# EAGLE design Power Board (EAGLE 9.6.2)
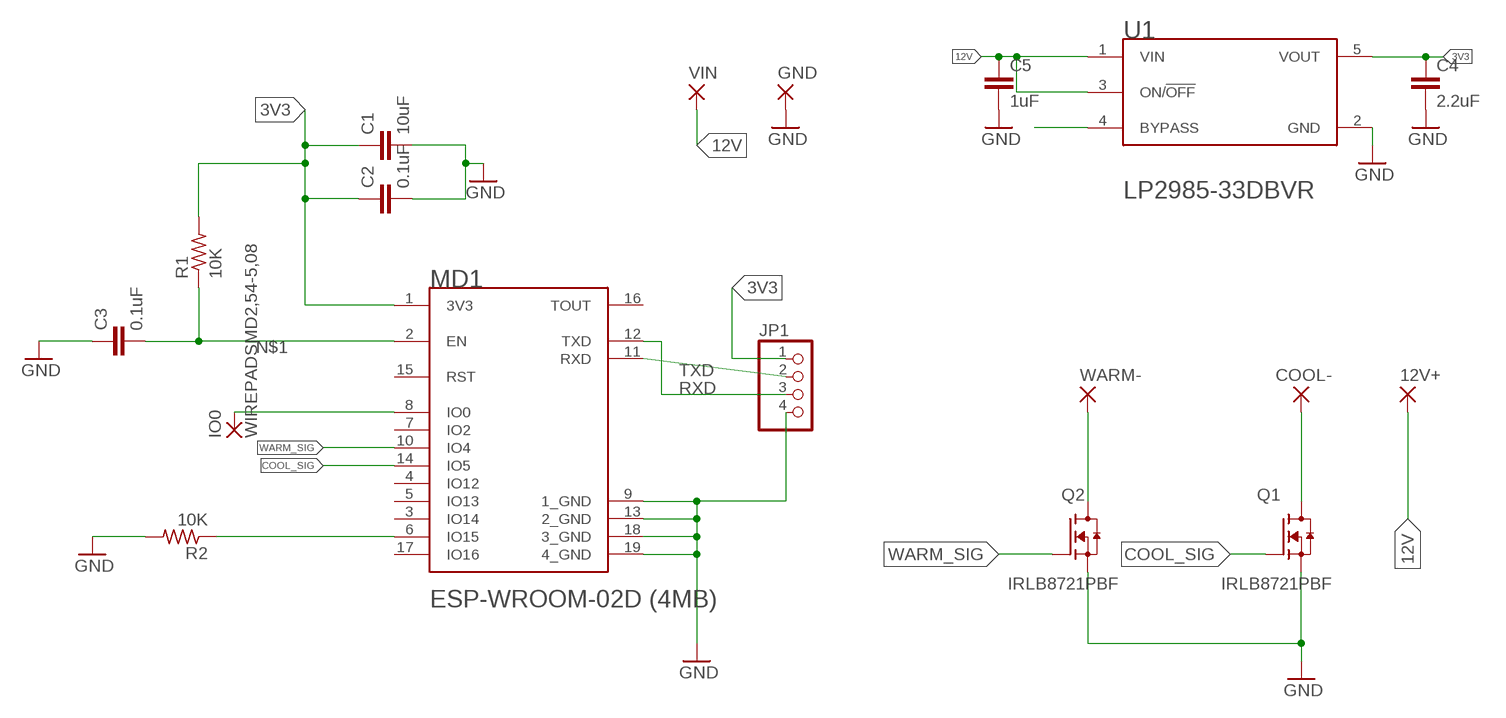
[diagram p0: schematic, sheet 1]

## Parts
12V+  WIREPADSMD5-2,5  [5-2,5]
C1  10uF  C-EUC1206  [C1206]
C2  0.1uF  C-EUC1206  [C1206]
C3  0.1uF  C-EUC1206  [C1206]
C4  2.2uF  C-EUC1206  [C1206]
C5  1uF  C-EUC1206  [C1206]
COOL-  WIREPADSMD5-2,5  [5-2,5]
GND  WIREPADSMD5-2,5  [5-2,5]
IO0  WIREPADSMD2,54-5,08  [SMD2,54-5,08]
JP1  PINHD-1X4  [1X04]
MD1  ESPRESSIF_SYSTEMS_ESP-WROOM-02D_4MBESPRESSIF_SYSTEMS_ESP-WROOM-02D_4MB_0_0  [ESPRESSIF_SYSTEMS_ESP-WROOM-02D_4MB_0]
Q1  IRLB8721PBF  [TO254P1067X483X2057-3]
Q2  IRLB8721PBF  [TO254P1067X483X2057-3]
R1  10K  R-US_R1206  [R1206]
R2  10K  R-US_R1206  [R1206]
U1  TEXAS_INSTRUMENTS_LP2985-33DBVRTEXAS_INSTRUMENTS_LP2985-33DBVR_0_0  [TEXAS_INSTRUMENTS_LP2985-33DBVR_0]
VIN  WIREPADSMD5-2,5  [5-2,5]
WARM-  WIREPADSMD5-2,5  [5-2,5]

## Nets
3V3 [POWER]: C1.1 C2.1 C4.1 JP1.1 MD1.1(3V3) R1.2 U1.5(VOUT)
12V [POWER]: 12V+.1(P) C5.1 U1.1(VIN) U1.3(ON/!OFF!) VIN.1(P)
COOL- [POWER]: COOL-.1(P) Q1.2(D)
COOL_SIG [SIGNAL]: MD1.14(IO5) Q1.1(G)
GND [POWER]: C1.2 C2.2 C3.1 C4.2 C5.2 GND.1(P) JP1.4 MD1.9(1_GND) MD1.13(2_GND) MD1.18(3_GND) MD1.19(4_GND) Q1.3(S) Q2.3(S) R2.2 U1.2(GND)
IO0: IO0.1(P) MD1.8(IO0)
N$1: C3.2 MD1.2(EN) R1.1
N$2: MD1.6(IO15) R2.1
N$7: U1.4(BYPASS)
RXD: JP1.2 MD1.11(RXD)
TXD: JP1.3 MD1.12(TXD)
WARM- [POWER]: Q2.2(D) WARM-.1(P)
WARM_SIG [SIGNAL]: MD1.10(IO4) Q2.1(G)
Unconnected: MD1.3(IO14) MD1.4(IO12) MD1.5(IO13) MD1.7(IO2) MD1.15(RST) MD1.16(TOUT) MD1.17(IO16)

## Library data of the parts
12V+ COOL- GND IO0 VIN WARM- = wirepad:WIREPAD: Wire PAD connect wire on PCB
C1-C5 = rcl:C-EU: CAPACITOR, European symbol; SPICEPREFIX: C
JP1 = pinhead:PINHD-1X4: PIN HEADER
MD1 = Espressif Systems - ESP-WROOM-02D (4MB):ESPRESSIF_SYSTEMS_ESP-WROOM-02D_4MB: WiFi 802.11b/g/n Transceiver Module 2.4GHz ~ 2.5GHz Integrated, Trace Surface Mount; AUTOMOTIVE: No; BANDWIDTH: 83.5MHz; CENTROID_NOT_SPECIFIED: No; DATASHEET: https://www.espressif.com/sites/default/files/documentation/esp-wroom-02u_esp-wroom-02d_datasheet_en.pdf; DATA_RATE: 72.2Mbits/s; DEVICE_CLASS_L1: Integrated Circuits (ICs); DEVICE_CLASS_L2: RF Semiconductors and Devices; DEVICE_CLASS_L3: Transceivers; DIGIKEY_DESCRIPTION: RX TXRX MOD WIFI TRACE ANT SMD; DIGIKEY_PART_NUMBER: 1965-ESP-WROOM-02D(4MB)CT-ND; FOOTPRINT_VARIANT_NAME_0: Recommended_Land_Pattern; HEIGHT: 3.3mm; INTERFACE: I2C,SPI,UART,I2S,Other; LEAD_FREE: Yes; MAX_FREQUENCY: 2483.5MHz; MAX_SUPPLY_VOLTAGE: 3.6V; MF: Espressif Systems; MFG_PACKAGE_IDENT: 0; MFG_PACKAGE_IDENT_DATE: 0; MFG_PACKAGE_IDENT_REV: 0; MIN_SUPPLY_VOLTAGE: 2.7V; MOUSER_PART_NUMBER: 356-ESPWROOM02D(4MB); MPN: ESP-WROOM-02D (4MB); NOMINAL_SUPPLY_CURRENT: 80mA; NUMBER_OF_ADC_CHANNELS: 1; NUMBER_OF_GPIO: 9; PACKAGE: SMT_MD_18MM00_20MM00; PREFIX: MD; RECEIVING_CURRENT: 56mA; ROHS: Yes; SENSITIVITY: -98dBm; TEMPERATURE_RANGE_HIGH: +85°C; TEMPERATURE_RANGE_LOW: -40°C; TRANSMITTING_CURRENT: 170mA; VERIFICATION_VERSION: 0.0.0.3
Q1 Q2 = IRLB8721PBF:IRLB8721PBF: Single N-Channel 30 V 8.7 mOhm 13 nC HEXFET® Power Mosfet - TO-220-3 Check availability <https://pricing.snapeda.com/parts/IRLB8721PBF/Infineon%20Technologies/view-part?ref=eda>; AVAILABILITY: In Stock; DESCRIPTION: Very Low RDS(on) at 4.5V VGS | Ultra-Low Gate Impedance | Fully Characterized Avalanche Voltage and Current | Lead-Free; MF: Infineon Technologies; MP: IRLB8721PBF; PACKAGE: TO-220 Infineon; PRICE: None; PURCHASE-URL: https://pricing.snapeda.com/search/part/IRLB8721PBF/?ref=eda
R1 R2 = rcl:R-US_: RESISTOR, American symbol; SPICEPREFIX: R
U1 = Texas Instruments - LP2985-33DBVR:TEXAS_INSTRUMENTS_LP2985-33DBVR: Linear Voltage Regulator IC 1 Output 150mA SOT-23-5; ACCURACY_PERCENTAGE: 1.5%; AUTOMOTIVE: No; CENTROID_NOT_SPECIFIED: No; CIIVA_IDS: 1248681; DATASHEET: https://www.ti.com/lit/ds/symlink/lp2985.pdf?ts=1595131254717&ref_url=https%253A%252F%252Fwww.ti.com%252Fstore%252Fti%252Fen%252Fp%252Fproduct%252F%253Fp%253DLP2985-33DBVR%2526keyMatch%253DLP2985-33DBVR%2526tisearch%253DSearch-EN-everything%2526usecase%253DOPN; DEVICE_CLASS_L1: Integrated Circuits (ICs); DEVICE_CLASS_L2: Power Management ICs; DEVICE_CLASS_L3: Voltage Regulators - Linear; DIGIKEY_DESCRIPTION: IC REG LINEAR 3.3V 150MA SOT23-5; DIGIKEY_PART_NUMBER: 296-18476-1-ND; DROPOUT_VOLTAGE: 280mV; FOOTPRINT_PARAMETERS_1: {"fp_type":"SOT23","params":{"N":{"default":"5","long name":"Number of leads","type":"multichoice","short name":"N"},"A":{"nom":false,"long name":"Height","min":900000,"max":1450000,"short name":"A","type":"measurement"},"A1":{"nom":false,"long name":"Package clearance","min":0,"max":150000,"short name":"A1","type":"measurement"},"A2":{"nom":false,"long name":"Package height","min":false,"max":1450000,"short name":"A2","type":"measurement"},"D":{"nom":false,"long name":"Package length","min":2750000,"max":3050000,"short name":"D","type":"measurement"},"E":{"nom":false,"long name":"Width /w leads","min":2600000,"max":3000000,"short name":"E","type":"measurement"},"E1":{"nom":false,"long name":"Package width","min":1450000,"max":1750000,"short name":"E1","type":"measurement"},"B":{"nom":false,"long name":"Lead width","min":300000,"max":500000,"short name":"B","type":"measurement"},"C":{"nom":false,"long name":"Lead thickness","min":80000,"max":220000,"short name":"C","type":"measurement"},"L":{"nom":false,"long name":"Lead foot length","min":300000,"max":600000,"short name":"L","type":"measurement"},"e":{"nom":950000,"long name":"Lead pitch","min":null,"max":null,"short name":"e","type":"measurement"},"PHI":{"nom":false,"long name":"Lead angle","min":0,"max":8000000,"short name":"PHI","type":"measurement"},"offset x":{"nom":0,"long name":"X Center offset","min":null,"max":null,"short name":"offset x","type":"measurement"},"offset y":{"nom":0,"long name":"Y Center offset","min":null,"max":null,"short name":"offset y","type":"measurement"},"LS":{"default":"Rounded rectangle","long name":"Land shape","type":"multichoice","short name":"LS"},"LS1":{"default":"Rectangle","long name":"Land shape (Pin 1)","type":"multichoice","short name":"LS1"},"solder toe":{"nom":550000,"long name":"Solder fillet (toe)","min":null,"max":null,"short name":"solder toe","type":"fixedmeasurement"},"solder heel":{"nom":450000,"long name":"Solder fillet (heel)","min":null,"max":null,"short name":"solder heel","type":"fixedmeasurement"},"solder side":{"nom":50000,"long name":"Solder fillet (side)","min":null,"max":null,"short name":"solder side","type":"fixedmeasurement"},"courtyard":{"nom":500000,"long name":"Courtyard","min":null,"max":null,"short name":"courtyard","type":"fixedmeasurement"},"SF":{"default":"A","long name":"Packing level","type":"multichoiceparent","short name":"SF","help":"http://support.upverter.com/customer/portal/articles/978783-what-is-a-footprint-packing-level","children":["solder toe","solder heel","solder side","courtyard"]}}}; FOOTPRINT_PARAMETERS_2: {"fp_type":"SOT23","params":{"N":{"default":"5","long name":"Number of leads","type":"multichoice","short name":"N"},"A":{"nom":false,"long name":"Height","min":900000,"max":1450000,"short name":"A","type":"measurement"},"A1":{"nom":false,"long name":"Package clearance","min":0,"max":150000,"short name":"A1","type":"measurement"},"A2":{"nom":false,"long name":"Package height","min":false,"max":1450000,"short name":"A2","type":"measurement"},"D":{"nom":false,"long name":"Package length","min":2750000,"max":3050000,"short name":"D","type":"measurement"},"E":{"nom":false,"long name":"Width /w leads","min":2600000,"max":3000000,"short name":"E","type":"measurement"},"E1":{"nom":false,"long name":"Package width","min":1450000,"max":1750000,"short name":"E1","type":"measurement"},"B":{"nom":false,"long name":"Lead width","min":300000,"max":500000,"short name":"B","type":"measurement"},"C":{"nom":false,"long name":"Lead thickness","min":80000,"max":220000,"short name":"C","type":"measurement"},"L":{"nom":false,"long name":"Lead foot length","min":300000,"max":600000,"short name":"L","type":"measurement"},"e":{"nom":950000,"long name":"Lead pitch","min":null,"max":null,"short name":"e","type":"measurement"},"PHI":{"nom":false,"long name":"Lead angle","min":0,"max":8000000,"short name":"PHI","type":"measurement"},"offset x":{"nom":0,"long name":"X Center offset","min":null,"max":null,"short name":"offset x","type":"measurement"},"offset y":{"nom":0,"long name":"Y Center offset","min":null,"max":null,"short name":"offset y","type":"measurement"},"LS":{"default":"Rounded rectangle","long name":"Land shape","type":"multichoice","short name":"LS"},"LS1":{"default":"Rectangle","long name":"Land shape (Pin 1)","type":"multichoice","short name":"LS1"},"solder toe":{"nom":350000,"long name":"Solder fillet (toe)","min":null,"max":null,"short name":"solder toe","type":"fixedmeasurement"},"solder heel":{"nom":350000,"long name":"Solder fillet (heel)","min":null,"max":null,"short name":"solder heel","type":"fixedmeasurement"},"solder side":{"nom":30000,"long name":"Solder fillet (side)","min":null,"max":null,"short name":"solder side","type":"fixedmeasurement"},"courtyard":{"nom":250000,"long name":"Courtyard","min":null,"max":null,"short name":"courtyard","type":"fixedmeasurement"},"SF":{"default":"B","long name":"Packing level","type":"multichoiceparent","short name":"SF","help":"http://support.upverter.com/customer/portal/articles/978783-what-is-a-footprint-packing-level","children":["solder toe","solder heel","solder side","courtyard"]}}}; FOOTPRINT_PARAMETERS_3: {"fp_type":"SOT23","params":{"N":{"default":"5","long name":"Number of leads","type":"multichoice","short name":"N"},"A":{"nom":false,"long name":"Height","min":900000,"max":1450000,"short name":"A","type":"measurement"},"A1":{"nom":false,"long name":"Package clearance","min":0,"max":150000,"short name":"A1","type":"measurement"},"A2":{"nom":false,"long name":"Package height","min":false,"max":1450000,"short name":"A2","type":"measurement"},"D":{"nom":false,"long name":"Package length","min":2750000,"max":3050000,"short name":"D","type":"measurement"},"E":{"nom":false,"long name":"Width /w leads","min":2600000,"max":3000000,"short name":"E","type":"measurement"},"E1":{"nom":false,"long name":"Package width","min":1450000,"max":1750000,"short name":"E1","type":"measurement"},"B":{"nom":false,"long name":"Lead width","min":300000,"max":500000,"short name":"B","type":"measurement"},"C":{"nom":false,"long name":"Lead thickness","min":80000,"max":220000,"short name":"C","type":"measurement"},"L":{"nom":false,"long name":"Lead foot length","min":300000,"max":600000,"short name":"L","type":"measurement"},"e":{"nom":950000,"long name":"Lead pitch","min":null,"max":null,"short name":"e","type":"measurement"},"PHI":{"nom":false,"long name":"Lead angle","min":0,"max":8000000,"short name":"PHI","type":"measurement"},"offset x":{"nom":0,"long name":"X Center offset","min":null,"max":null,"short name":"offset x","type":"measurement"},"offset y":{"nom":0,"long name":"Y Center offset","min":null,"max":null,"short name":"offset y","type":"measurement"},"LS":{"default":"Rounded rectangle","long name":"Land shape","type":"multichoice","short name":"LS"},"LS1":{"default":"Rectangle","long name":"Land shape (Pin 1)","type":"multichoice","short name":"LS1"},"solder toe":{"nom":150000,"long name":"Solder fillet (toe)","min":null,"max":null,"short name":"solder toe","type":"fixedmeasurement"},"solder heel":{"nom":250000,"long name":"Solder fillet (heel)","min":null,"max":null,"short name":"solder heel","type":"fixedmeasurement"},"solder side":{"nom":10000,"long name":"Solder fillet (side)","min":null,"max":null,"short name":"solder side","type":"fixedmeasurement"},"courtyard":{"nom":100000,"long name":"Courtyard","min":null,"max":null,"short name":"courtyard","type":"fixedmeasurement"},"SF":{"default":"C","long name":"Packing level","type":"multichoiceparent","short name":"SF","help":"http://support.upverter.com/customer/portal/articles/978783-what-is-a-footprint-packing-level","children":["solder toe","solder heel","solder side","courtyard"]}}}; FOOTPRINT_VARIANT_NAME_0: Recommended_Land_Pattern; FOOTPRINT_VARIANT_NAME_1: IPC_A; FOOTPRINT_VARIANT_NAME_2: IPC_B; FOOTPRINT_VARIANT_NAME_3: IPC_C; HEIGHT: 1.45mm; IMPORTED_FROM: vault; IMPORT_TS: 1521842000; LEAD_FREE: Yes; MAX_JUNCTION_TEMP: +125°C; MAX_SUPPLY_VOLTAGE: 16V; MF: Texas Instruments; MFG_PACKAGE_IDENT: DBV0005A; MFG_PACKAGE_IDENT_COMPONENT_ID: c49ef776f172da8a; MFG_PACKAGE_IDENT_DATE: 0; MFG_PACKAGE_IDENT_REV: 0; MIN_SUPPLY_VOLTAGE: 2.2V; MOUSER_DESCRIPTION: 150mA Low-Noise Low-Dropout Regulator With Shutdown 5-SOT-23 -40 to 125; MOUSER_PART_NUMBER: 595-LP2985-33DBVR; MPN: LP2985-33DBVR; NOMINAL_SUPPLY_CURRENT: 65-850uA; NUMBER_OF_OUTPUTS: 1; OUTPUT_CURRENT: 150mA; OUTPUT_TYPE: Fixed; OUTPUT_VOLTAGE: 3.3V; PACKAGE: SOT23-5; PREFIX: U; RELEASE_DATE: 1464593020; ROHS: Yes; STANDOFF_HEIGHT: 0mm; TEMPERATURE_RANGE_HIGH: +125°C; TEMPERATURE_RANGE_LOW: -40°C; VAULT_GUID: 48C3448F-8292-488F-BD4D-80D38EC3DFBF; VERIFICATION_VERSION: 0.0.0.3

## Net classes
1 POWER: width 0.305 mm

## Board
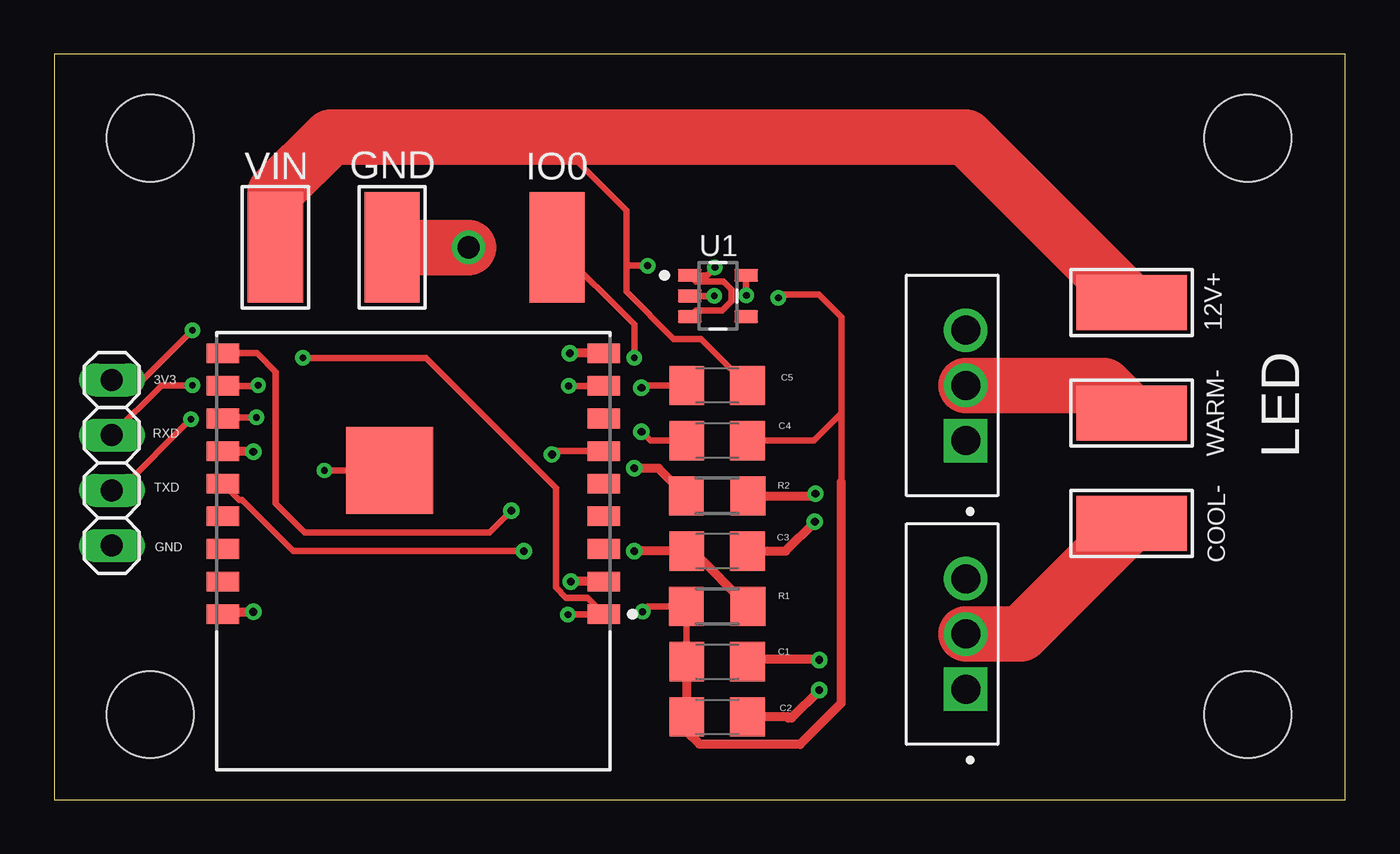
[diagram p1: board, top side]
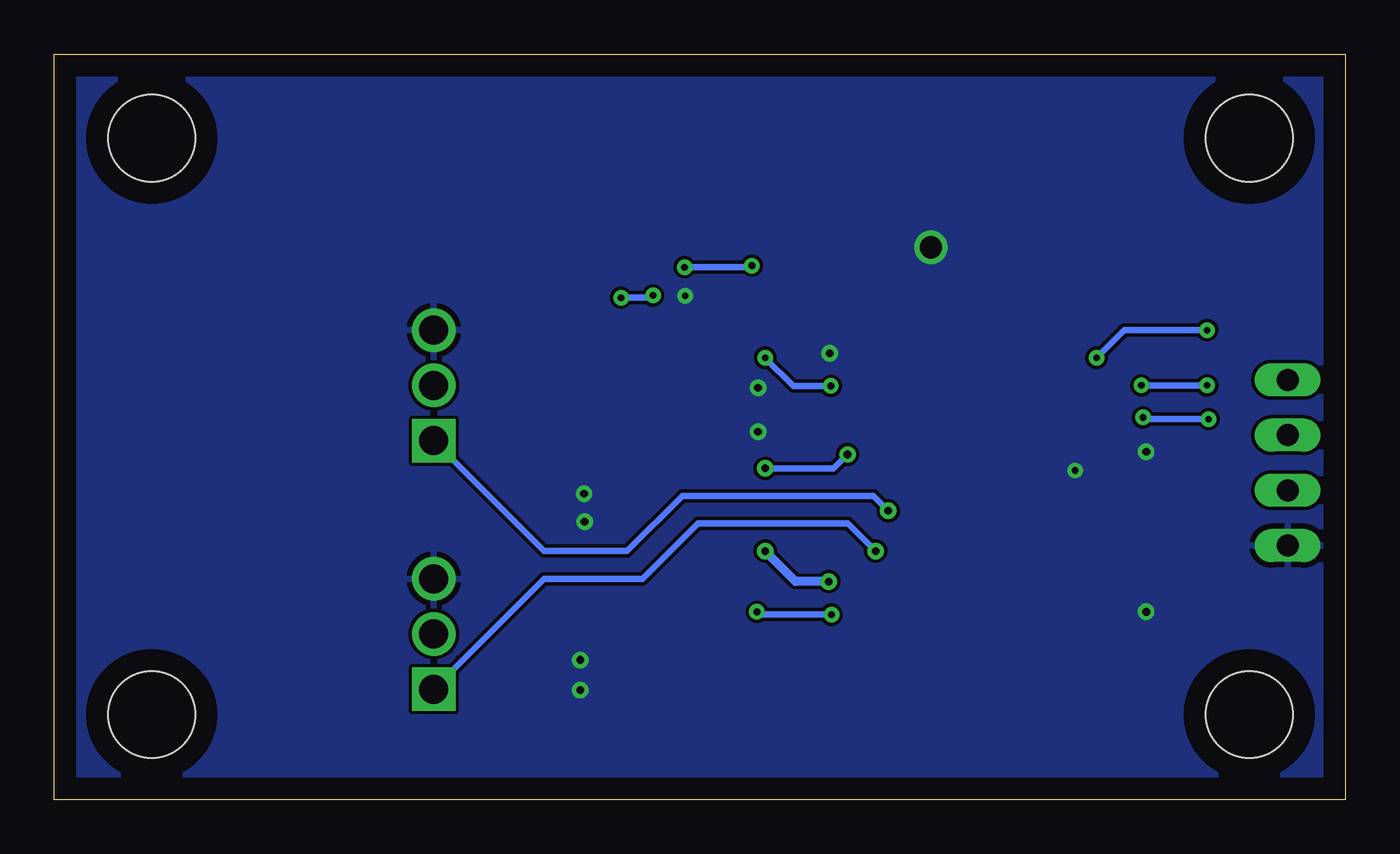
[diagram p2: board, bottom side, seen from below]

Size 59.36 x 34.28 mm. Coordinates in mm from the lower left corner, seen from the top.
Outline: 0,0 59.36,0 59.36,34.28 0,34.28 0,0
Copper layers (1*16): Top 0.035mm / dielectric 1.5mm / Bottom 0.035mm
Design rules "default *": minimum track width 6mil, minimum drill 0.3mm, track to track 6mil, track to pad 6mil, pad to pad 6mil, via to via 6mil, smd to smd 6mil, copper to edge 40mil, drill to drill 6mil, minimum pad ring 10mil, minimum via ring 8mil, stop-mask expansion 4mil, vias tented up to drill 0mil, thermal gap 10mil
Holes 3.99 mm at 54.89,30.42 54.89,3.91 4.41,30.42 4.41,3.91

### Footprints (pad centres in the part's own frame; a part is rotated, then mirrored left to right if it is on the bottom)
5-2,5 = smd 2.54 x 5.08: 1 0,0
C1206 = smd 1.6 x 1.8: 1 -1.4,0; 2 1.4,0
SMD2,54-5,08 = smd 2.54 x 5.08: 1 0,0
1X04 = drill 1.016 long: 1 -3.81,0; 2 -1.27,0; 3 1.27,0; 4 3.81,0
ESPRESSIF_SYSTEMS_ESP-WROOM-02D_4MB_0 = smd 1.5 x 0.9: 1 -8.75,2.9; 2 -8.75,1.4; 3 -8.75,-0.1; 4 -8.75,-1.6; 5 -8.75,-3.1; 6 -8.75,-4.6; 7 -8.75,-6.1; 8 -8.75,-7.6; 9 -8.75,-9.1; 10 8.75,-9.1; 11 8.75,-7.6; 12 8.75,-6.1; 13 8.75,-4.6; 14 8.75,-3.1; 15 8.75,-1.6; 16 8.75,-0.1; 17 8.75,1.4; 18 8.75,2.9 | smd 4 x 4: 19 1.1,-3.71
TO254P1067X483X2057-3 = drill 1.33 pad 2 square: 1 -2.54,0 | drill 1.33 pad 2: 2 0,0; 3 2.54,0
R1206 = smd 1.6 x 1.803: 1 -1.422,0; 2 1.422,0
TEXAS_INSTRUMENTS_LP2985-33DBVR_0 = smd 1.1 x 0.6: 1 -1.3,0.95; 2 -1.3,0; 3 -1.3,-0.95; 4 1.3,-0.95; 5 1.3,0.95

### Placement (x,y rotation side)
12V+  49.53,22.86 90 top
C1  30.48,6.35 0 top
C2  30.48,3.81 0 top
C3  30.48,11.43 180 top
C4  30.48,16.51 180 top
C5  30.48,19.05 180 top
COOL-  49.53,12.7 90 top
GND  15.53,25.4 180 top
IO0  23.11,25.4 0 top
JP1  2.64,15.49 270 top
MD1  16.51,11.43 180 top
Q1  41.91,7.62 90 top
Q2  41.91,19.05 90 top
R1  30.48,8.89 180 top
R2  30.48,13.97 0 top
U1  30.52,23.16 0 top
VIN  10.16,25.4 180 top
WARM-  49.53,17.78 90 top

### Tracks (layer width: path | path; a pad name or v marks a point on that pad's centre or on a via)
3V3  (via drill 0.3)
  Top 0.305: 36.2,14.61 36.2,17.78 | C1.1 29.08,8.87 R1.2 27.3,8.89 v27.05,8.64 | C4.1 34.92,16.51 36.2,17.78 | 36.2,17.78 36.2,22.2 35.15,23.24 33.45,23.24 v33.3,23.09 | v31.83,23.19 31.82,23.2 U1.5 | JP1.1 4.06,19.3 v6.35,21.59 | v11.43,20.32 17.09,20.32 23.07,14.34 23.07,9.75 23.54,9.28 24.52,9.28 MD1.1 23.64,8.53 v23.62,8.51
  Top 0.406: C1.1 C2.1 29.08,3.14 29.66,2.55 34.28,2.55 34.29,2.54 36.2,4.45 36.2,14.61
  Bottom 0.305: v33.3,23.09 31.93,23.09 v31.83,23.19 | v6.35,21.59 10.16,21.59 v11.43,20.32 | v23.62,8.51 26.92,8.51 v27.05,8.64
12V  (via drill 0.3)
  Top 0.305: U1.3 29.51,22.5 30.7,22.5 31.14,22.94 31.14,23.46 30.78,23.82 29.51,23.82 U1.1 30.01,24.11 v30.38,24.49 | v27.28,24.56 26.31,24.56 | 22.94,30.48 26.31,27.1 26.31,24.56 | C5.1 29.74,21.19 28.48,21.19 26.31,23.36 26.31,24.56
  Top 2.54: VIN.1 10.16,27.94 12.7,30.48 22.94,30.48 41.91,30.48 12V+.1
  Bottom 0.305: v30.38,24.49 27.36,24.49 v27.28,24.56
COOL-
  Top 2.54: COOL-.1 44.45,7.62 Q1.2
COOL_SIG  (via drill 0.35)
  Top 0.305: MD1.14 8.51,13.79 8.64,13.79 10.99,11.43 v21.59,11.43
  Bottom 0.305: v21.59,11.43 22.86,12.7 29.77,12.7 32.31,10.16 36.83,10.16 Q1.1
GND  (via drill 0.3, 0.35, 1.02)
  Top 0.305: C4.2 27.41,16.51 v27,16.92 | C5.2 27.11,19.05 v27,18.95 | v30.35,23.16 U1.2 | MD1.19 v12.42,15.14
  Top 0.406: MD1.13 9.12,16.03 v9.14,16 | MD1.18 7.87,8.64 v9.14,8.64 | v35.18,5.03 33.91,3.76 33.74,3.76 33.73,3.81 C2.2 | v35.18,6.43 35.18,6.45 31.98,6.45 C1.2 | C3.1 33.63,11.43 v34.98,12.78 | R2.2 34.9,13.97 v35,14.07 | v27,18.95 | MD1.9 v23.7,20.53 v23.7,20.52
  Top 2.54: 15.53,25.15 GND.1 v19.05,25.4
  pour Bottom: -5.08,36.83 -5.08,-1.27 -6.35,-2.54 62.23,-2.54 62.23,35.56 63.5,36.83
IO0  (via drill 0.3)
  Top 0.305: IO0.1 26.67,21.84 v26.67,20.32 | v23.65,19.02 MD1.8
  Bottom 0.305: v26.67,20.32 25.38,19.02 v23.65,19.02
N$1  (via drill 0.35)
  Top 0.406: R1.1 29.36,11.43 C3.2 v26.67,11.43 | MD1.2 v23.75,10.03
  Bottom 0.406: v23.75,10.03 25.27,10.03 v26.67,11.43
N$2  (via drill 0.35)
  Top 0.305: v22.89,15.88 23.04,16.03 MD1.6
  Top 0.406: R2.1 27.79,15.24 v26.67,15.24
  Bottom 0.305: v26.67,15.24 23.52,15.24 v22.89,15.88
RXD  (via drill 0.3)
  Top 0.305: JP1.2 4.93,19.05 v6.35,19.05 | v9.37,19.05 9.35,19.03 MD1.11
  Bottom 0.305: v6.35,19.05 v9.37,19.05
TXD  (via drill 0.3)
  Top 0.305: JP1.3 3,14.22 v6.27,17.5 | v9.3,17.58 7.81,17.58 MD1.12
  Bottom 0.305: v6.27,17.5 9.22,17.5 v9.3,17.58
WARM-
  Top 2.54: WARM-.1 48.26,19.05 Q2.2
WARM_SIG  (via drill 0.35)
  Top 0.305: MD1.10 9.31,20.53 10.19,19.66 10.19,13.61 11.51,12.29 20.02,12.29 v21.01,13.28
  Bottom 0.305: v21.01,13.28 21.69,13.97 30.48,13.97 33.02,11.43 36.83,11.43 Q2.1

### Text on the board
tNames: 3V3 | RXD | LED | TXD | GND